# Altium schematic sheet Sheet1.SchDoc
size A4
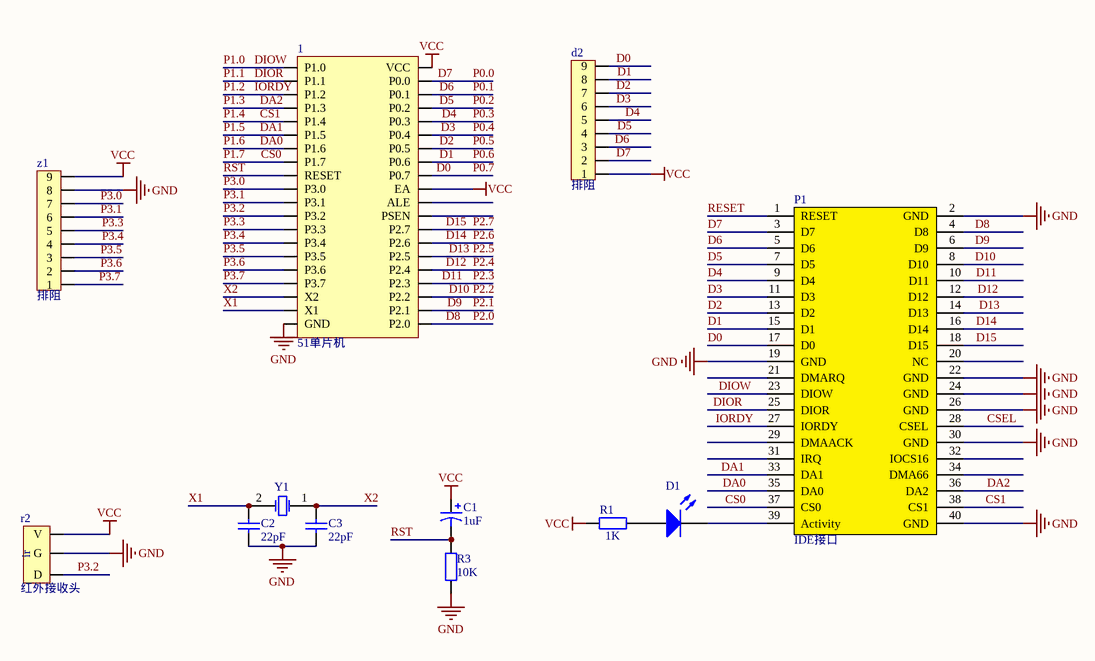
[diagram p0: Sheet1.SchDoc]

## Parts
1  51单片机  [51单片机]
C1  value 1uF  [电解电容]  (hidden comment: Cap Pol1)
C2  value 22pF  [无极电容]  (hidden comment: Cap)
C3  value 22pF  [无极电容]  (hidden comment: Cap)
D1  LED0  [LED]  (value not drawn)
d2  排阻  [排阻]
P1  IDE接口  [IDE接口封装40PIN]
R1  value 1K  [电阻]  (hidden comment: Res2)
r2  红外接收头  [IR红外接收头]
R3  value 10K  [电阻]  (hidden comment: Res2)
Y1  XTAL  [晶振]  (value not drawn)
z1  排阻  [排阻]

## Nets
GND: 1.20(GND) C2.1 C3.2 P1.2(GND) P1.19(GND) P1.22(GND) P1.24(GND) P1.26(GND) P1.30(GND) P1.40(GND) r2.2(G) R3.2 z1.8
VCC: 1.31(EA) 1.40(VCC) C1.1 d2.1 R1.1 r2.3(V) z1.9
CS0: 1.8(P1.7) P1.37(CS0)  [also labelled P1.7]
CS1: 1.5(P1.4) P1.38(CS1)  [also labelled P1.4]
CSEL: P1.28(CSEL)
D0: 1.32(P0.7) d2.9 P1.17(D0)  [also labelled P0.7]
D1: 1.33(P0.6) d2.8 P1.15(D1)  [also labelled P0.6]
D2: 1.34(P0.5) d2.7 P1.13(D2)  [also labelled P0.5]
D3: 1.35(P0.4) d2.6 P1.11(D3)  [also labelled P0.4]
D4: 1.36(P0.3) d2.5 P1.9(D4)  [also labelled P0.3]
D5: 1.37(P0.2) d2.4 P1.7(D5)  [also labelled P0.2]
D6: 1.38(P0.1) d2.3 P1.5(D6)  [also labelled P0.1]
D7: 1.39(P0.0) d2.2 P1.3(D7)  [also labelled P0.0]
D8: 1.21(P2.0) P1.4(D8)  [also labelled P2.0]
D9: 1.22(P2.1) P1.6(D9)  [also labelled P2.1]
D10: 1.23(P2.2) P1.8(D10)  [also labelled P2.2]
D11: 1.24(P2.3) P1.10(D11)  [also labelled P2.3]
D12: 1.25(P2.4) P1.12(D12)  [also labelled P2.4]
D13: 1.26(P2.5) P1.14(D13)  [also labelled P2.5]
D14: 1.27(P2.6) P1.16(D14)  [also labelled P2.6]
D15: 1.28(P2.7) P1.18(D15)  [also labelled P2.7]
DA0: 1.7(P1.6) P1.35(DA0)  [also labelled P1.6]
DA1: 1.6(P1.5) P1.33(DA1)  [also labelled P1.5]
DA2: 1.4(P1.3) P1.36(DA2)  [also labelled P1.3]
DIOR: 1.2(P1.1) P1.25(DIOR)  [also labelled P1.1]
DIOW: 1.1(P1.0) P1.23(DIOW)  [also labelled P1.0]
IORDY: 1.3(P1.2) P1.27(IORDY)  [also labelled P1.2]
P3.0: 1.10(P3.0) z1.7
P3.1: 1.11(P3.1) z1.6
P3.2: 1.12(P3.2) r2.1(D)
P3.3: 1.13(P3.3) z1.5
P3.4: 1.14(P3.4) z1.4
P3.5: 1.15(P3.5) z1.3
P3.6: 1.16(P3.6) z1.2
P3.7: 1.17(P3.7) z1.1
RESET: P1.1(RESET)
RST: 1.9(RESET) C1.2 R3.1
X1: 1.19(X1) C2.2 Y1.2(OSC2)
X2: 1.18(X2) C3.1 Y1.1(OSC1)
NetD1_1: D1.1(A) R1.2
NetD1_2: D1.2(K) P1.39(Activity)

Not connected (* = marked no-connect by the designer): 1 29(PSEN) 30(ALE); P1 20(NC) 21(DMARQ) 29(DMAACK) 31(IRQ) 32(IOCS16) 34(DMA66)

## Notes on the sheet
- (in symbol 红外接收头) ir

## Library data of the parts
C1 = Cap Pol1: Polarized Capacitor (Radial); Published: 8-Jun-2000; LatestRevisionDate: 17-Jul-2002; LatestRevisionNote: Re-released for DXP Platform.; PackageReference: RB7.6-15; Publisher: Altium Limited; PackageDescription: Polarized Capacitor (Radial); 2 Leads
C2 C3 = Cap: Capacitor; Published: 8-Jun-2000; LatestRevisionDate: 17-Jul-2002; LatestRevisionNote: Re-released for DXP Platform.; PackageReference: RAD-0.3; Publisher: Altium Limited; PackageDescription: Radial Cap, Thru-Hole; 2 Leads; 0.3 in Pin Spacing
D1 = LED0: Typical INFRARED GaAs LED; Published: 8-Jun-2000; LatestRevisionDate: 08-Jul-2005; LatestRevisionNote: Mech Layer 1 removed.; PackageReference: LED-0; Publisher: Altium Limited; PackageDescription: LED; 2 Leads
R1 R3 = Res2: Resistor; Published: 8-Jun-2000; LatestRevisionDate: 17-Jul-2002; LatestRevisionNote: Re-released for DXP Platform.; PackageReference: AXIAL-0.4; Publisher: Altium Limited; PackageDescription: Axial Device, Thru-Hole; 2 Leads; 0.4 in Pin Spacing
Y1 = XTAL: Crystal Oscillator; Published: 8-Jun-2000; LatestRevisionDate: 17-Jul-2002; LatestRevisionNote: Re-released for DXP Platform.; PackageReference: R38; Publisher: Altium Limited; PackageDescription: Crystal, Thru-Hole; 2 Leads; Body 3.1 x 8.2 mm (Dia.xH)